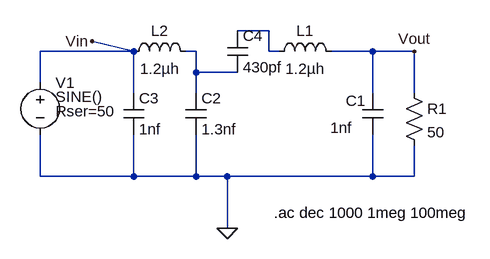
[diagram p0: schematic 40MBandpass.asc]
40MBandpass.asc, the LTspice schematic file:
Version 4
SHEET 1 880 680
WIRE 496 192 448 192
WIRE 288 224 224 208
WIRE 288 224 144 224
WIRE 384 224 368 224
WIRE 496 224 496 192
WIRE 512 224 496 224
WIRE 656 224 592 224
WIRE 720 224 656 224
WIRE 384 256 384 224
WIRE 448 256 384 256
WIRE 144 272 144 224
WIRE 288 288 288 224
WIRE 384 288 384 256
WIRE 656 288 656 224
WIRE 720 288 720 224
WIRE 144 416 144 352
WIRE 288 416 288 352
WIRE 288 416 144 416
WIRE 384 416 384 352
WIRE 384 416 288 416
WIRE 432 416 384 416
WIRE 656 416 656 352
WIRE 656 416 432 416
WIRE 720 416 720 368
WIRE 720 416 656 416
WIRE 432 496 432 416
FLAG 720 224 Vout
FLAG 432 496 0
FLAG 224 208 Vin
SYMBOL voltage 144 256 R0
WINDOW 3 24 38 Left 2
WINDOW 39 24 60 Left 2
SYMATTR Value SINE()
SYMATTR SpiceLine Rser=50
SYMATTR InstName V1
SYMATTR Value2 AC 1
SYMBOL res 704 272 R0
SYMATTR InstName R1
SYMATTR Value 50
SYMBOL cap 272 288 R0
SYMATTR InstName C3
SYMATTR Value 1nf
SYMBOL cap 640 288 R0
WINDOW 0 -25 12 Left 2
WINDOW 3 -49 53 Left 2
SYMATTR InstName C1
SYMATTR Value 1nf
SYMBOL ind 272 240 R270
WINDOW 0 32 56 VTop 2
WINDOW 3 5 56 VBottom 2
SYMATTR InstName L2
SYMATTR Value 1.2µh
SYMBOL ind 496 240 R270
WINDOW 0 32 56 VTop 2
WINDOW 3 5 56 VBottom 2
SYMATTR InstName L1
SYMATTR Value 1.2µh
SYMBOL cap 368 288 R0
SYMATTR InstName C2
SYMATTR Value 1.3nf
SYMBOL Cap 432 192 R0
SYMATTR InstName C4
SYMATTR Value 430pf
TEXT 504 472 Left 2 !.ac dec 1000 1meg 100meg

The netlist it stands for:
* 40MBandpass.asc
V1 Vin 0 SINE() AC 1 Rser=50
R1 Vout 0 50
C3 Vin 0 1nf
C1 Vout 0 1nf
L2 Vin N002 1.2µh
L1 N001 Vout 1.2µh
C2 N002 0 1.3nf
C4 N001 N002 430pf
.ac dec 1000 1meg 100meg
.backanno
.end